# EasyEDA schematic BLERADAR-V15_2020-10-21_11-23-24.json
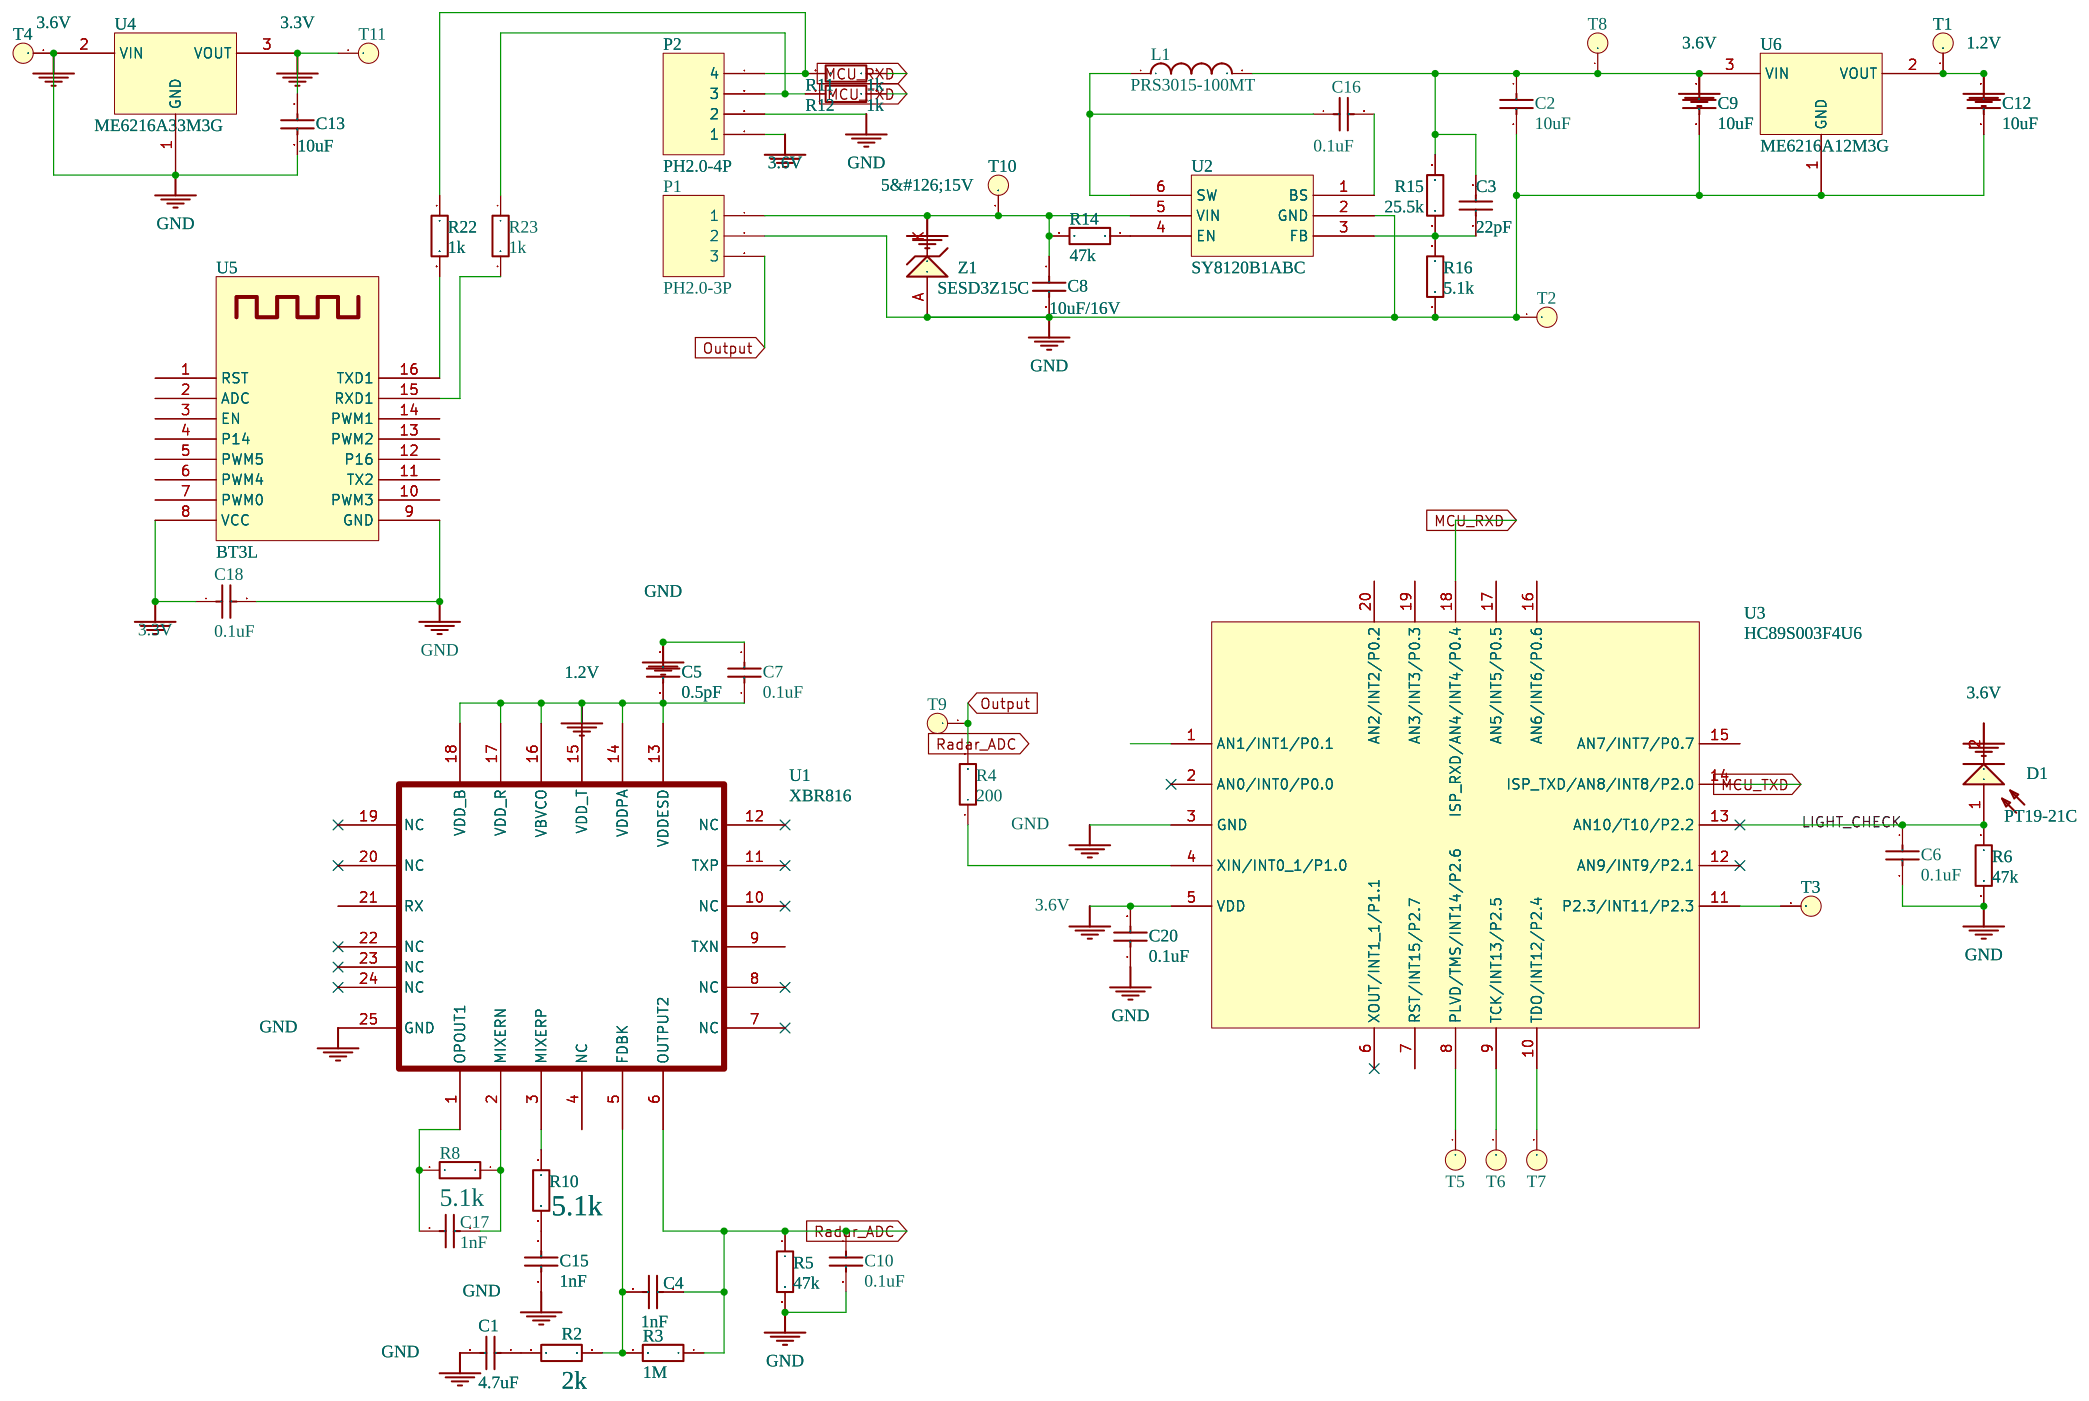
[diagram p0: schematic sheet]

## Parts
C1  4.7uF  [C0402]
C2  10uF  [C0402]
C3  22pF  [C0402]
C4  1nF  [C0402]
C5  0.5pF  [C0402]
C6  0.1uF  [C0402]
C7  0.1uF  [C0402]
C8  10uF/16V  [C0603]
C9  10uF  [C0402]
C10  0.1uF  [C0402]
C12  10uF  [C0402]
C13  10uF  [C0402]
C15  1nF  [C0402]
C16  0.1uF  [C0402]
C17  1nF  [C0402]
C18  0.1uF  [C0402]
C20  0.1uF  [C0402]
D1  PT19-21C  [LED-0603]
L1  PRS3015-100MT  [PRS3015]
P1  PH2.0-3P  [PH2.0-3P-LTZ]
P2  PH2.0-4P  [HDR1X4]
R2  2k  [R0402]
R3  1M  [R0402]
R4  200  [R0402]
R5  47k  [R0402]
R6  47k  [R0402]
R8  5.1k  [R0402]
R10  5.1k  [R0402]
R11  1k  [R0402]
R12  1k  [R0402]
R14  47k  [R0402]
R15  25.5k  [R0402]
R16  5.1k  [R0402]
R22  1k  [R0402]
R23  1k  [R0402]
T1  NO  [TESTPOINTS]
T2  NO  [TESTPOINTS]
T3  NO  [TESTPOINTS]
T4  NO  [TESTPOINTS]
T5  NO  [TESTPOINTS]
T6  NO  [TESTPOINTS]
T7  NO  [TESTPOINTS]
T8  NO  [TESTPOINTS]
T9  NO  [TESTPOINTS]
T10  NO  [TESTPOINTS]
T11  NO  [TESTPOINTS]
U1  XBR816  [XBR816]
U2  SY8120B1ABC  [SOT-23-6]
U3  HC89S003F4U6  [QFN20(3*3)]
U4  ME6216A33M3G  [SOT-23-L]
U5  BT3L  [ZS3L]
U6  ME6216A12M3G  [SOT-23-L]
Z1  SESD3Z15C  [SOD323]

## Library data of the parts
C1-C10 C12 C13 C15-C18 C20 = -: Published: 8-Jun-2000; LatestRevisionDate: 17-Jul-2002; LatestRevisionNote: Re-released for DXP Platform.; PackageReference: RAD-0.3; Publisher: Altium Limited; PackageDescription: Radial Cap, Thru-Hole; 2 Leads; 0.3 in Pin Spacing; Comment: =Value
D1 = -: Published: 24-Mar-1999; LatestRevisionDate: 17-Jul-2002; LatestRevisionNote: Re-released for DXP Platform.; PackageReference: PIN2; Publisher: Altium Limited; Comment: =Value
L1 = -: Published: 8-Jun-2000; LatestRevisionDate: 29-May-2009; LatestRevisionNote: IPC-7351 Footprint Added.; PackageReference: 0402-A; Publisher: Altium Limited; PackageDescription: Chip Inductor; Code_JEITA: 0402; Code_IEC: 1005; Comment: =Value
P1 P2 = -: LatestRevisionDate: 17-Jul-2002; LatestRevisionNote: Re-released for DXP Platform.; Publisher: Altium Limited
R2-R6 R8 R10-R12 R14-R16 R22 R23 = -: Published: 8-Jun-2000; LatestRevisionDate: 17-Jul-2002; LatestRevisionNote: Re-released for DXP Platform.; PackageReference: AXIAL-0.4; Publisher: Altium Limited; PackageDescription: Axial Device, Thru-Hole; 2 Leads; 0.4 in Pin Spacing; Comment: =Value
Z1 = -: Published: 8-Jun-2000; LatestRevisionDate: 17-Jul-2002; LatestRevisionNote: Re-released for DXP Platform.; PackageReference: DIODE-0.7; Publisher: Altium Limited; PackageDescription: Diode, Thru-Hole; 2 Leads; 0.7 in Pin Spacing

## Nets
1.2V: C5.1 C7.1 C12.1 T1.1 U1.13(VDDESD) U1.14(VDDPA) U1.15(VDD_T) U1.16(VBVCO) U1.17(VDD_R) U1.18(VDD_B) U6.2(VOUT)
3.3V: C13.1 C18.1 T11.1 U4.3(VOUT) U5.8(VCC)
3.6V: C1.2 C2.1 C2.2 C3.2 C5.2 C6.2 C7.2 C8.2 C9.1 C9.2 C10.2 C12.2 C13.2 C15.1 C18.2 C20.1 C20.2 D1.2(K) L1.2 P1.2 P2.1 P2.2 R5.2 R6.2 R15.2 R16.1 T2.1 T4.1 T8.1 U1.25(GND) U2.2(GND) U3.3(GND) U3.5(VDD) U4.1(GND) U4.2(VIN) U5.9(GND) U6.1(GND) U6.3(VIN) Z1.A
5&#126;15V: C8.1 P1.1 R14.2 T10.1 U2.5(VIN) Z1.K
LIGHT_CHECK: C6.1 D1.1(A) R6.1 U3.13(AN10/T10/P2.2)
MCU_RXD: R11.1 U3.18(ISP_RXD/AN4/INT4/P0.4)
MCU_TXD: R12.1 U3.14(ISP_TXD/AN8/INT8/P2.0)
Output: P1.3 R4.2 T9.1
Radar_ADC: C4.1 C10.1 R3.1 R5.1 U1.6(OUTPUT2) U3.1(AN1/INT1/P0.1)
Net-(C1-1): C1.1 R2.1
Net-(C3-1): C3.1 R15.1 R16.2 U2.3(FB)
Net-(C4-2): C4.2 R2.2 R3.2 U1.5(FDBK)
Net-(C15-2): C15.2 R10.2
Net-(C16-1): C16.1 L1.1 U2.6(SW)
Net-(C16-2): C16.2 U2.1(BS)
Net-(C17-1): C17.1 R8.1 U1.2(MIXERN)
Net-(C17-2): C17.2 R8.2 U1.1(OPOUT1)
Net-(P2-3): P2.3 R12.2 R23.1
Net-(P2-4): P2.4 R11.2 R22.1
Net-(R4-1): R4.1 U3.4(XIN/INT0_1/P1.0)
Net-(R10-1): R10.1 U1.3(MIXERP)
Net-(R14-1): R14.1 U2.4(EN)
Net-(R22-2): R22.2 U5.16(TXD1)
Net-(R23-2): R23.2 U5.15(RXD1)
Net-(T3-1): T3.1 U3.11(P2.3/INT11/P2.3)
Net-(T5-1): T5.1 U3.8(PLVD/TMS/INT14/P2.6)
Net-(T6-1): T6.1 U3.9(TCK/INT13/P2.5)
Net-(T7-1): T7.1 U3.10(TDO/INT12/P2.4)

Not connected (* = marked no-connect by the designer): U1 4(NC) 7(NC)* 8(NC)* 9(TXN) 10(NC)* 11(TXP)* 12(NC)* 19(NC)* 20(NC)* 21(RX) 22(NC)* 23(NC)* 24(NC)*; U3 2(AN0/INT0/P0.0)* 6(XOUT/INT1_1/P1.1)* 7(RST/INT15/P2.7) 12(AN9/INT9/P2.1)* 15(AN7/INT7/P0.7) 16(AN6/INT6/P0.6) 17(AN5/INT5/P0.5) 19(AN3/INT3/P0.3) 20(AN2/INT2/P0.2); U5 1(RST) 2(ADC) 3(EN) 4(P14) 5(PWM5) 6(PWM4) 7(PWM0) 10(PWM3) 11(TX2) 12(P16) 13(PWM2) 14(PWM1)
